# Altium schematic sheet V1.0.SchDoc
size 127 x 88 mm
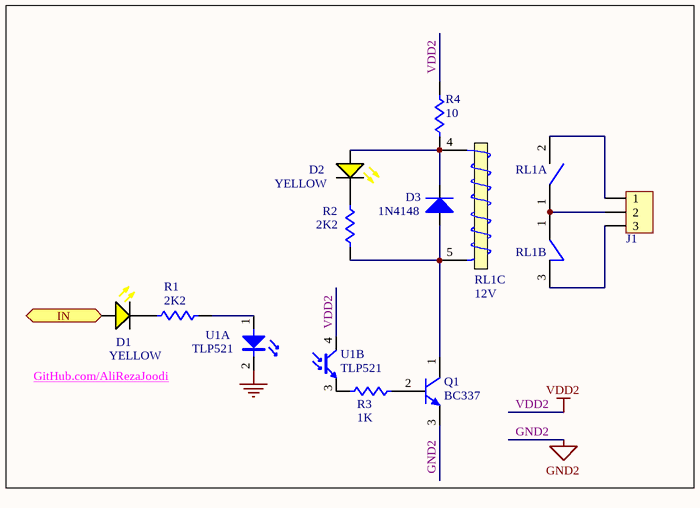
[diagram p0: V1.0.SchDoc]

## Parts
D1  YELLOW  [LED_THD_5MM_YELLOW]
D2  YELLOW  [LED_THD_5MM_YELLOW]
D3  1N4148  [DIODE0.4_Glass]
J1  3PIN  (value not drawn)
Q1  BC337  [TO92C]
R1  2K2  [AXIAL-0.4]
R2  2K2  [AXIAL-0.4]
R3  1K  [AXIAL-0.4]
R4  10  [AXIAL-0.4]
RL1  12V  [RELAY-SPDT-1]  (value not drawn)  (parts A,B,C of 3)
U1  TLP521  [DIP_4]  (parts A,B of 2)

## Ports
IN (in)

## Nets
GND: U1.2(K)
GND2: Q1.3(E)
VDD2: R4.1 U1.4(C)
IN: D1.1(A) ; port IN
NetD1_2: D1.2(K) R1.2
NetD2_1: D2.1(A) D3.2(K) R4.2 RL1.4(T1)
NetD2_2: D2.2(K) R2.1
NetD3_1: D3.1(A) Q1.1(C) R2.2 RL1.5(T2)
NetJ1_1: J1.1 RL1.2(NC)
NetJ1_2: J1.2 RL1.1(COM)
NetJ1_3: J1.3 RL1.3(NC)
NetQ1_2: Q1.2(B) R3.1
NetR1_1: R1.1 U1.1(A)
NetR3_2: R3.2 U1.3(E)

## Notes on the sheet
- GitHub.com/AliRezaJoodi

## Library data of the parts
D1 D2 = LED_YELLOW: LED, Yellow; Manufacturer: Generic Components; Class I: Optoelectronic; Published: 8-Jun-2000; Revision: July-2002: Re-released for DXP Platform.; Publisher: Altium Limited; Class II: LED
D3 = Diode: Default Diode; Manufacturer: Generic Components; Class I: Discrete; Class II: Diode - Switching; Published: 8-Jun-2000; Revision: July-2002: Re-released for DXP Platform.; Publisher: Altium Limited
J1 = Connector_Header_3Pin: Connector, Header, 3Pin; Revision: July-2002: Re-released for DXP Platform.
Q1 = NPN: NPN Bipolar Transistor; Manufacturer: Generic Components; Class I: Discrete; Class II: BJT - Low Power; Published: 8-Jun-2000; Revision: July-2002: Re-released for DXP Platform.; Publisher: Altium Limited
R1-R4 = Res1: Resistor; Manufacturer: Generic Components; Class I: Passive; Published: 8-Jun-2000; Revision: July-2002: Re-released for DXP Platform.; Publisher: Altium Limited; Class II: Resistor
RL1 = Relay_SPDT_3: SPDT Relay; Manufacturer: Generic Components; Class I: Electro-mechanical; Published: 8-Jun-2000; Revision: July-2002: Re-released for DXP Platform.; Publisher: Altium Limited; Class II: Relay
U1 = Optoisolator: Publisher: Altium Limited